# Altium schematic sheet 8ChanDirTranslation.SchDoc: 8-Channel Directional Translation
size Letter; DocumentNumber: 13; SheetNumber: 13; SheetTotal: 28
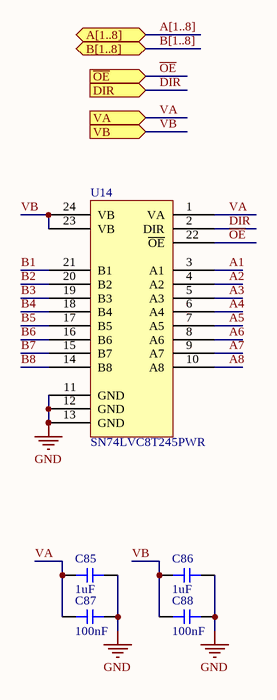
[diagram p0: 8ChanDirTranslation.SchDoc]

## Parts
C85  value 1uF  [0603-CAP]  (hidden comment: Capacitor)
C86  value 1uF  [0603-CAP]  (hidden comment: Capacitor)
C87  value 100nF  [0603-CAP]  (hidden comment: Capacitor)
C88  value 100nF  [0603-CAP]  (hidden comment: Capacitor)
U14  SN74LVC8T245PWR  [TSSOP24]

## Ports
A[1..8] (bidir), B[1..8] (bidir), DIR (in), VA (in), VB (in), ~{OE} (in)

## Nets
GND: C85.2 C86.2 C87.2 C88.2 U14.11(GND) U14.12(GND) U14.13(GND)
A1: U14.3(A1)
A2: U14.4(A2)
A3: U14.5(A3)
A4: U14.6(A4)
A5: U14.7(A5)
A6: U14.8(A6)
A7: U14.9(A7)
A8: U14.10(A8)
B1: U14.21(B1)
B2: U14.20(B2)
B3: U14.19(B3)
B4: U14.18(B4)
B5: U14.17(B5)
B6: U14.16(B6)
B7: U14.15(B7)
B8: U14.14(B8)
DIR: U14.2(DIR) ; port DIR
~{OE}: U14.22(~{OE}) ; port ~{OE}
VA: C85.1 C87.1 U14.1(VA) ; port VA
VB: C86.1 C88.1 U14.23(VB) U14.24(VB) ; port VB

## Buses and harness runs
bus A[1..8] = port A[1..8]
bus B[1..8] = port B[1..8]

## Notes on the sheet
- Title
- Size:
- Date:
- Letter
- Number:
- Time:
- Revision:
- Sheet
- of
- File:
- Drawn By:

## Library data of the parts
U14 = SN74LVC8T245PWR: IC BUS TRANSCVR 8BIT 24TSSOP; Supplier 1: Digi-Key; Supplier Part Number 1: 296-18593-2-ND